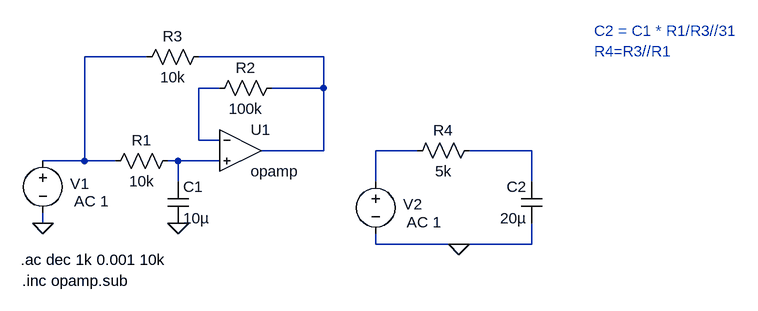
[diagram p0: schematic EJE3_B.asc]
EJE3_B.asc, the LTspice schematic file:
Version 4
SHEET 1 928 680
WIRE -32 -48 -128 -48
WIRE 240 -48 48 -48
WIRE 80 0 48 0
WIRE 240 0 240 -48
WIRE 240 0 160 0
WIRE 48 80 48 0
WIRE 80 80 48 80
WIRE 240 96 240 0
WIRE 240 96 144 96
WIRE 384 96 320 96
WIRE 560 96 464 96
WIRE -128 112 -128 -48
WIRE -128 112 -192 112
WIRE -80 112 -128 112
WIRE 16 112 0 112
WIRE 80 112 16 112
WIRE 16 144 16 112
WIRE 320 144 320 96
WIRE 560 144 560 96
WIRE -192 208 -192 192
WIRE 320 240 320 224
WIRE 448 240 320 240
WIRE 560 240 560 208
WIRE 560 240 448 240
FLAG -192 208 0
FLAG 16 208 0
FLAG 448 240 0
SYMBOL OpAmps\\opamp 112 32 R0
SYMATTR InstName U1
SYMATTR SpiceLine2 GBW=100Meg
SYMBOL voltage -192 96 R0
WINDOW 0 42 51 Left 2
WINDOW 123 48 78 Left 2
WINDOW 39 0 0 Left 0
SYMATTR InstName V1
SYMATTR Value2 AC 1
SYMATTR Value ""
SYMBOL res 176 -16 R90
WINDOW 0 0 56 VBottom 2
WINDOW 3 32 56 VTop 2
SYMATTR InstName R2
SYMATTR Value 100k
SYMBOL res 64 -64 R90
WINDOW 0 0 56 VBottom 2
WINDOW 3 32 56 VTop 2
SYMATTR InstName R3
SYMATTR Value 10k
SYMBOL cap 0 144 R0
SYMATTR InstName C1
SYMATTR Value 10µ
SYMBOL res 16 96 R90
WINDOW 0 0 56 VBottom 2
WINDOW 3 32 56 VTop 2
SYMATTR InstName R1
SYMATTR Value 10k
SYMBOL res 480 80 R90
WINDOW 0 0 56 VBottom 2
WINDOW 3 32 56 VTop 2
SYMATTR InstName R4
SYMATTR Value 5k
SYMBOL cap 576 208 R180
WINDOW 0 24 56 Left 2
WINDOW 3 24 8 Left 2
SYMATTR InstName C2
SYMATTR Value 20µ
SYMBOL voltage 320 128 R0
WINDOW 0 42 51 Left 2
WINDOW 123 48 78 Left 2
WINDOW 39 0 0 Left 0
SYMATTR InstName V2
SYMATTR Value2 AC 1
SYMATTR Value ""
TEXT 656 -88 Left 2 ;C2 = C1 * R1/R3//31\nR4=R3//R1
TEXT -226 264 Left 2 !.ac dec 1k 0.001 10k
TEXT -224 296 Left 2 !.inc opamp.sub

The netlist it stands for:
* EJE3_B.asc
XU1 N003 N006 N002 opamp Aol=100K GBW=100Meg  ; pins invin noninvin out
V1 N001 0 AC 1
R2 N002 N003 100k
R3 N002 N001 10k
C1 N006 0 10µ
R1 N006 N001 10k
R4 N005 N004 5k
C2 0 N005 20µ
V2 N004 0 AC 1
* C2 = C1 * R1/R3//31
* R4=R3//R1
.ac dec 1k 0.001 10k
.inc opamp.sub
.backanno
.end